# Altium schematic sheet vmon-and-imon-measurements-hw.SchDoc
size A4; DrawnBy: Rogério J. M.; Revision: V1.0; SheetNumber: 2; SheetTotal: 5
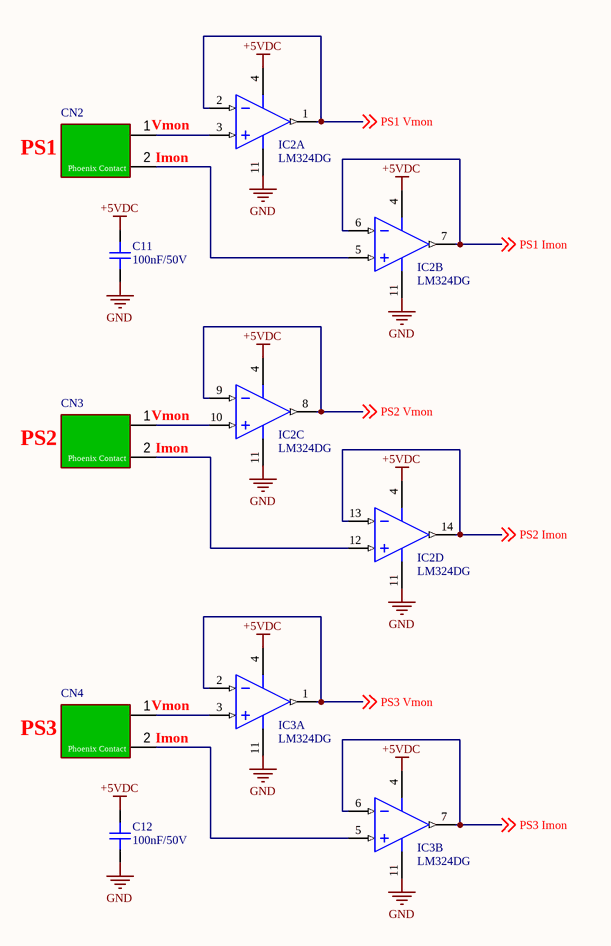
[diagram p0: vmon-and-imon-measurements-hw.SchDoc]

## Parts
C11  100nF/50V  [C0805]
C12  100nF/50V  [C0805]
CN2  1755736  [Conector Phoenix 2 vias 1755736]  (value not drawn)
CN3  1755736  [Conector Phoenix 2 vias 1755736]  (value not drawn)
CN4  1755736  [Conector Phoenix 2 vias 1755736]  (value not drawn)
IC2  LM324DG  [SOIC-14]  (parts A,B,C,D of 4)
IC3  LM324DG  [SOIC-14]  (parts A,B of 4)

## Nets
+5VDC: C11.2 C12.2 IC2.4(V+) IC3.4(V+)
GND: C11.1 C12.1 IC2.11(V-) IC3.11(V-)
PS1 Imon: IC2.6(IN_B-) IC2.7(OUT_B) ; off-sheet PS1 Imon
PS1 Vmon: IC2.1(OUT_A) IC2.2(IN_A-) ; off-sheet PS1 Vmon
PS2 Imon: IC2.13(IN_D-) IC2.14(OUT_D) ; off-sheet PS2 Imon
PS2 Vmon: IC2.8(OUT_C) IC2.9(IN_C-) ; off-sheet PS2 Vmon
PS3 Imon: IC3.6(IN_B-) IC3.7(OUT_B) ; off-sheet PS3 Imon
PS3 Vmon: IC3.1(OUT_A) IC3.2(IN_A-) ; off-sheet PS3 Vmon
NetCN2_1: CN2.1 IC2.3(IN_A+)
NetCN2_2: CN2.2 IC2.5(IN_B+)
NetCN3_1: CN3.1 IC2.10(IN_C+)
NetCN3_2: CN3.2 IC2.12(IN_D+)
NetCN4_1: CN4.1 IC3.3(IN_A+)
NetCN4_2: CN4.2 IC3.5(IN_B+)

## Notes on the sheet
- PS1
- (near CN2) Vmon
- (near CN2) Imon
- (near CN3) Vmon
- PS2
- (near CN3) Imon
- (near CN4) Vmon
- PS3
- (near CN4) Imon
- Drawn by:
- Title:
- Revision:
- File:
- Date:
- Project:
- Time:
- Variant:
- Sheet
- of
- DAT - INE - EMI
  Eletrônica e
  Microeletrônica
- Copyright CNPEM 2023.
  This documentation describes Open Hardware and is licensed under the CERN OHL S v2. You may redistribute and modify this documentation under the terms of the CERN OHL S v2. (https://www.ohwr.org/cernohl). This documentation is distributed WITHOUT ANY EXPRESS OR IMPLIED WARRANTY, INCLUDING OF MERCHANTABILITY, SATISFACTORY QUALITY AND FITNESS FOR A PARTICULAR PURPOSE. Please see the CERN OHL S v2 for applicable conditions.

## Library data of the parts
C11 C12 = CAPACITOR 100nF/50V: Capacitor 0.1UF 50V X7R 0805; Manufacturer 1: Kyocera AVX; Manufacturer Part Number 1: 08055C104KAZ2A; Description 1: Capacitor Ceramic 0.1uF 50V X7R 10% SMD 0805 FlexiTerm 125C Paper T/R; Category 1: Ceramic Capacitors; Capacitance: 100nF; Tolerance: 10%; Temperature Coefficient: 30ppm/°C; Dissipation Factor: 2.5%; Código LNLS: AP106675; Supplier 1: Arrow Electronics; Supplier Part Number 1: 08055C104KAZ2A; RoHS 1: Yes; Stock 1: 28000; Pricing 1: 4000=0,0262 (USD); Mount: Surface Mount,PCB; Case/Package: 0805; Number of Pins: 2; Case Code (Metric): 2012; Case Code (Imperial): 0805; Min Operating Temperature: -55°C; Max Operating Temperature: 125°C; Packaging: Tape and Reel; Voltage Rating (DC): 50V; Dielectric: X7R; Package Quantity: 4000; Series: FLEXITERM®; Voltage Rating: 50V; Termination: SMD/SMT; Voltage: 50V; Features: Soft Termination; Construction: Flat; Length: 2.01mm; Width: 1.25mm; Height: 0.94mm; Depth: 1.25mm; Reach SVHC Compliant: No; Lead Free: Lead Free; RoHS Compliant: Yes; ComponentLink1URL: https://datasheet.ciiva.com/28613/630895-28613376.pdf?src-supplier=Element14; ComponentLink1Description: https://datasheet.ciiva.com/28613/630895-28613376.pdf?src-supplier=Element14; ComponentLink2URL: https://datasheet.ciiva.com/11788/0900766b80dc2409-11788550.pdf?src-supplier=Rs; ComponentLink2Description: https://datasheet.ciiva.com/11788/0900766b80dc2409-11788550.pdf?src-supplier=Rs; ComponentLink3URL: https://datasheet.ciiva.com/30514/2014094-30514066.pdf?src-supplier=Jameco; ComponentLink3Description: https://datasheet.ciiva.com/30514/2014094-30514066.pdf?src-supplier=Jameco; ComponentLink4URL: https://datasheet.ciiva.com/11499/flexiterm-11499901.pdf?src-supplier=Avnet; ComponentLink4Description: https://datasheet.ciiva.com/11499/flexiterm-11499901.pdf?src-supplier=Avnet; ComponentLink5URL: https://datasheet.ciiva.com/5417/cx7r-218113-5417323.pdf?src-supplier=Mouser; ComponentLink5Description: https://datasheet.ciiva.com/5417/cx7r-218113-5417323.pdf?src-supplier=Mouser; ComponentLink6URL: https://datasheet.ciiva.com/28613/630895-28613368.pdf?src-supplier=Element14; ComponentLink6Description: https://datasheet.ciiva.com/28613/630895-28613368.pdf?src-supplier=Element14; ComponentLink7URL: https://datasheet.ciiva.com/151/flexiterm-151512.pdf?src-supplier=Digi-Key; ComponentLink7Description: https://datasheet.ciiva.com/151/flexiterm-151512.pdf?src-supplier=Digi-Key; ComponentLink8URL: https://datasheet.ciiva.com/151/flexiterm-151513.pdf?src-supplier=Digi-Key; ComponentLink8Description: https://datasheet.ciiva.com/151/flexiterm-151513.pdf?src-supplier=Digi-Key; ComponentLink9URL: https://datasheet.ciiva.com/151/flexiterm-151514.pdf?src-supplier=Digi-Key; ComponentLink9Description: https://datasheet.ciiva.com/151/flexiterm-151514.pdf?src-supplier=Digi-Key; ComponentLink10URL: https://datasheet.ciiva.com/14602/70001075-14602617.pdf?src-supplier=Allied+Electronics; ComponentLink10Description: https://datasheet.ciiva.com/14602/70001075-14602617.pdf?src-supplier=Allied+Electronics; ComponentLink11URL: https://datasheet.ciiva.com/16427/cx7r-16427406.pdf?src-supplier=Future+Electronics; ComponentLink11Description: https://datasheet.ciiva.com/16427/cx7r-16427406.pdf?src-supplier=Future+Electronics
CN2-CN4 = CONECTOR PHOENIX 2 VIAS 1755736: Manufacturer: Phoenix Contact; Number of Positions: 2; Number of Levels: 1; Pitch: 0.200" (5.08mm); Header Orientation: Vertical; Current - IEC: 12A; Voltage - IEC: 630V; Voltage - UL: 300V; Material Flammability Rating: UL94 V-0; Contact Tail Length: 0.154" (3.90mm); Código LNLS: MT101663; Supplier 1: Digi-Key; Manufacturer Part Number: 1755736; RoHS: RoHS Compliant; Category: Connectors, Interconnects; Stock 1: 11008; Pricing 1: 1=0.59, 10=0.564, 50=0.539, 100=0.5243, 250=0.49, 500=0.4508, 1000=0.4165, 2500=0.3969, 5000=0.3724 (USD); Packaging: Bulk; Part Status: Active; Type: Header, Male Pins, Shrouded (4 Side); Positions Per Level: 2; Plug Wire Entry: -; Termination Style: Solder; Mounting Type: Through Hole; Current - UL: 12A; Wire Gauge or Range - AWG: -; Wire Gauge or Range - mm²: -; Color: Green; Operating Temperature: -; Contact Mating Finish: Tin; Features: -; Ingress Protection: -; Screw Size: -; Torque - Screw: -; Wire Strip Length: -; Contact Material: -; Housing Material: Polyamide (PA), Nylon; Insulation Height: 0.472" (12.00mm); ComponentLink1URL: http://media.digikey.com/pdf/Data%20Sheets/Phoenix%20Contact%20PDFs/1755736.pdf; ComponentLink1Description: http://media.digikey.com/pdf/Data%20Sheets/Phoenix%20Contact%20PDFs/1755736.pdf; Supplier Part Number 1: 277-1150-ND
IC2 IC3 = LM324DG: Operational Amplifiers - Op Amps 3-32V Quad 5mV; Manufacturer 1: Texas Instruments; Manufacturer Part Number 1: LM324DG4; Description 1: 4-Channel industry standard operational amplifier 14-SOIC 0 to 70; Category 1: Amplifiers - Op Amps, Buffer, Instrumentation; Operating Supply Voltage: 16V; Voltage Gain: 100dB; Slew Rate: 0.5V/µs; Common Mode Rejection Ratio: 65dB; Number of Channels: 4; Output Current: 30mA; Max Supply Voltage: 32V; Min Supply Voltage: 3V; Min Dual Supply Voltage: 1.5V; Gain Bandwidth Product: 1.2MHz; Input Bias Current: 20nA; Input Offset Voltage (Vos): 3mV; Operating Supply Current: 1.4mA; Output Current per Channel: 60mA; Amplifier Type: GENERAL PURPOSE; Supply Current: 3mA; Código LNLS: MT104472; Supplier 1: Mouser; Supplier Part Number 1: 595-LM324DG4; RoHS 1: Yes; Stock 1: 4026; Pricing 1: 1=0,9, 10=0,761, 50=0,761, 100=0,583, 1000=0,407, 10000=0,381 (USD); Mount: Surface Mount; Case/Package: SOIC; Number of Pins: 14; Min Operating Temperature: 0°C; Max Operating Temperature: 70°C; Package Quantity: 50; Packaging: Rail/Tube; Max Dual Supply Voltage: 16V; Number of Circuits: 4; Bandwidth: 1.2MHz; Technology: BIPOLAR; Radiation Hardening: No; Lead Free: Lead Free; RoHS Compliant: Yes; ComponentLink1URL: https://datasheet.ciiva.com/1811/lm224-1811004.pdf?src-supplier=Digi-Key; ComponentLink1Description: https://datasheet.ciiva.com/1811/lm224-1811004.pdf?src-supplier=Digi-Key